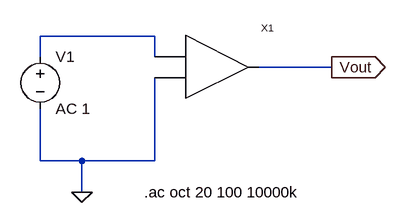
[diagram p0: schematic Uncompensated.asc]
Uncompensated.asc, the LTspice schematic file:
Version 4
SHEET 1 880 680
WIRE 128 144 -48 144
WIRE -48 176 -48 144
WIRE 128 176 128 144
WIRE 400 192 288 192
WIRE -48 336 -48 256
WIRE 16 336 -48 336
WIRE 128 336 128 208
WIRE 128 336 16 336
WIRE 16 384 16 336
FLAG 400 192 Vout
IOPIN 400 192 Out
FLAG 16 384 0
SYMBOL OpAmp 208 192 R0
SYMATTR InstName X1
SYMBOL voltage -48 160 R0
SYMATTR InstName V1
SYMATTR Value AC 1
TEXT 112 384 Left 2 !.ac oct 20 100 10000k

The netlist it stands for:
* Uncompensated.asc
XX1 N001 0 Vout OpAmp  ; pins ViP Vim Vo
V1 N001 0 AC 1
.ac oct 20 100 10000k
.backanno
.end